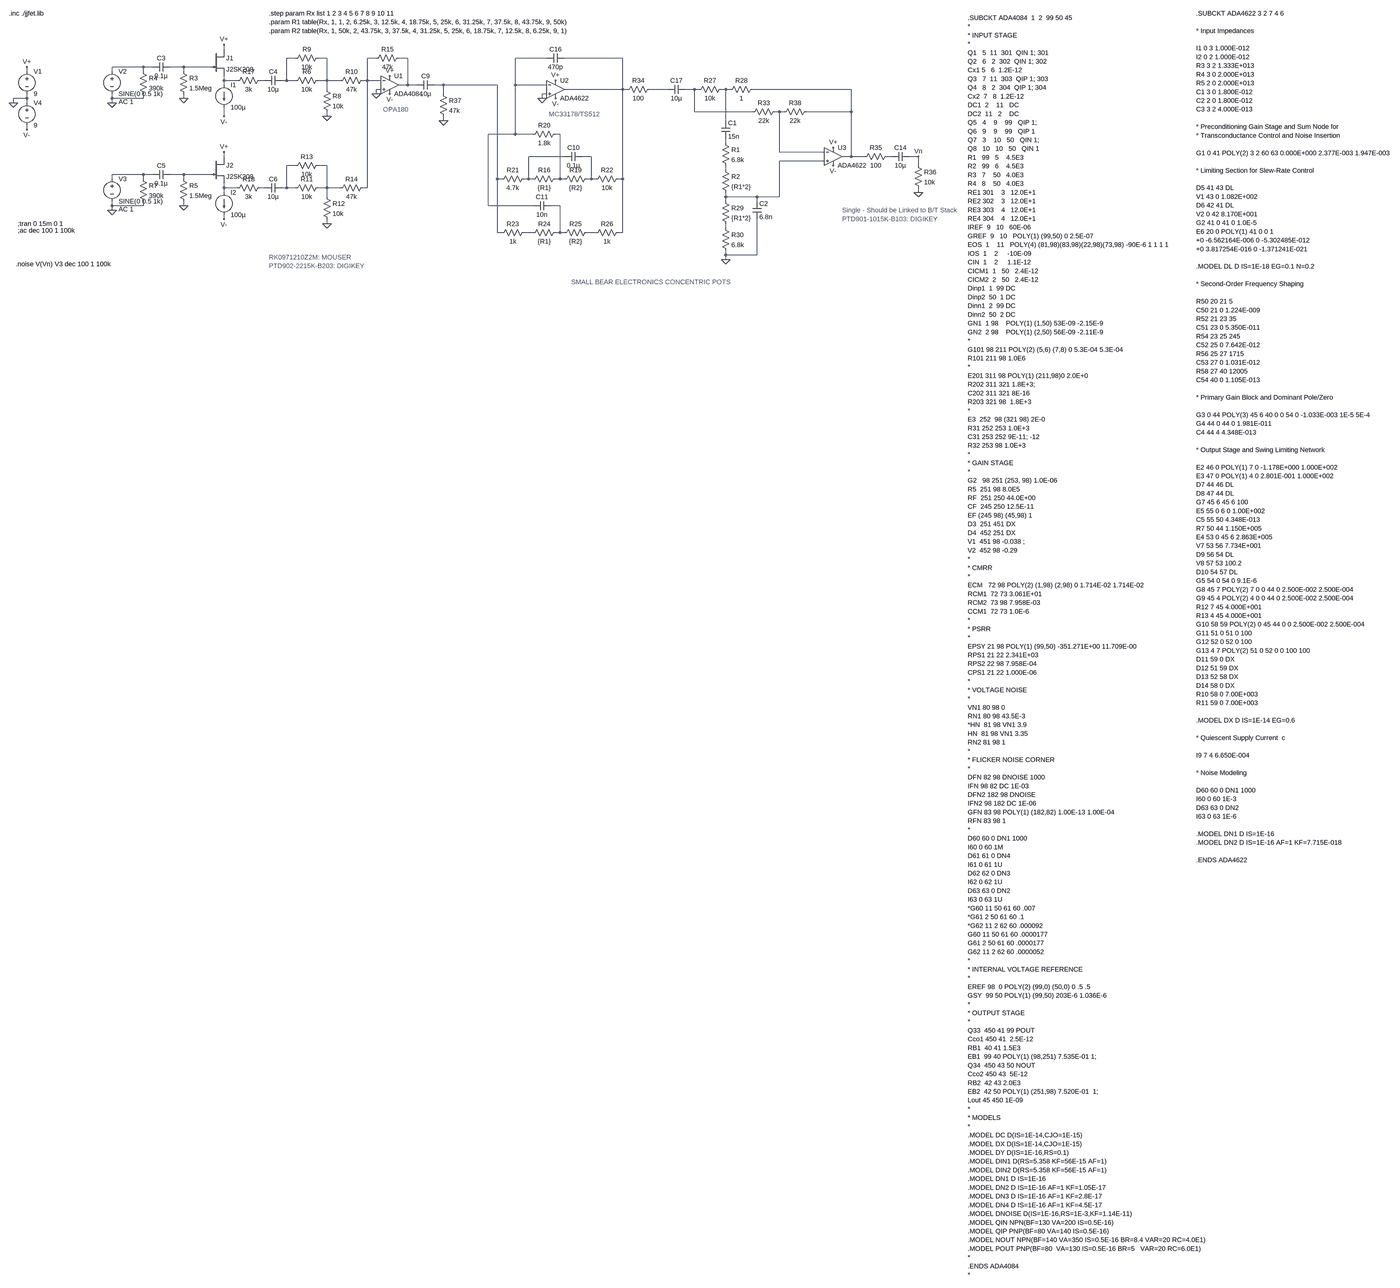
[diagram p0: schematic CB_BGP_V0.asc, whole sheet]
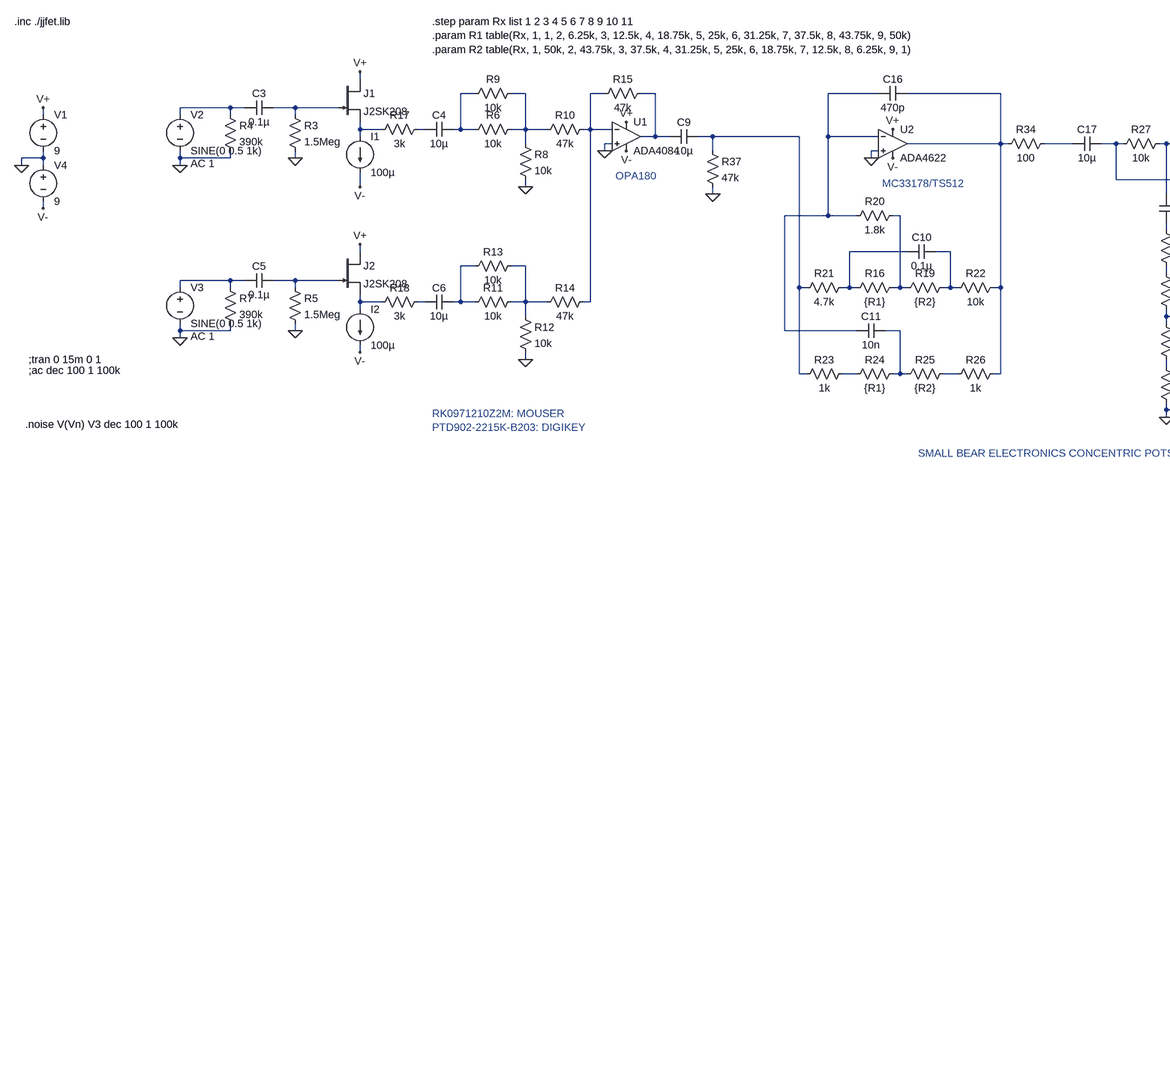
[diagram p1: schematic CB_BGP_V0.asc, part, row 1 of 2, column 1 of 2]
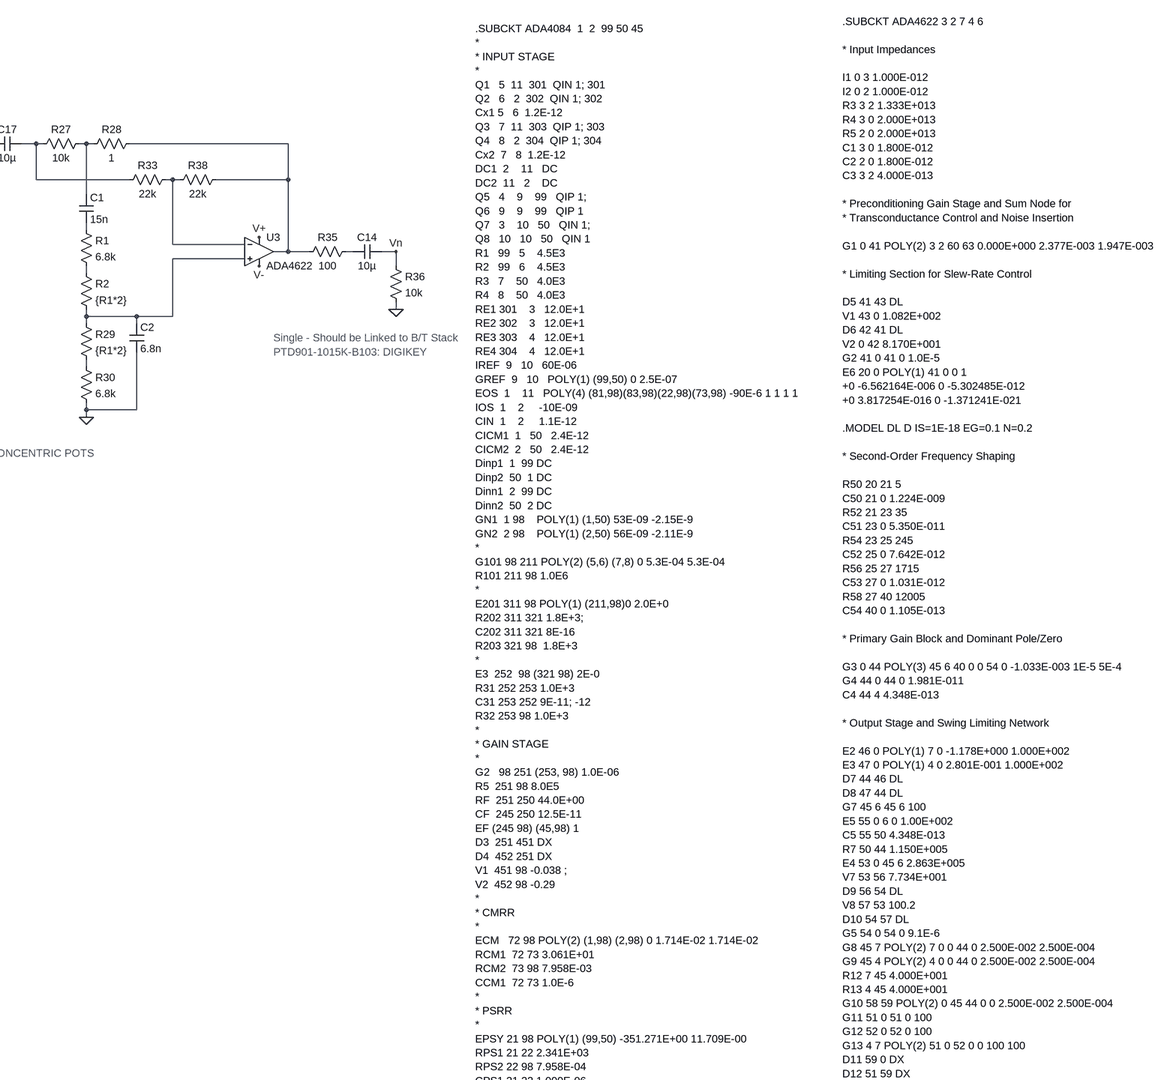
[diagram p2: schematic CB_BGP_V0.asc, part, row 1 of 2, column 2 of 2]
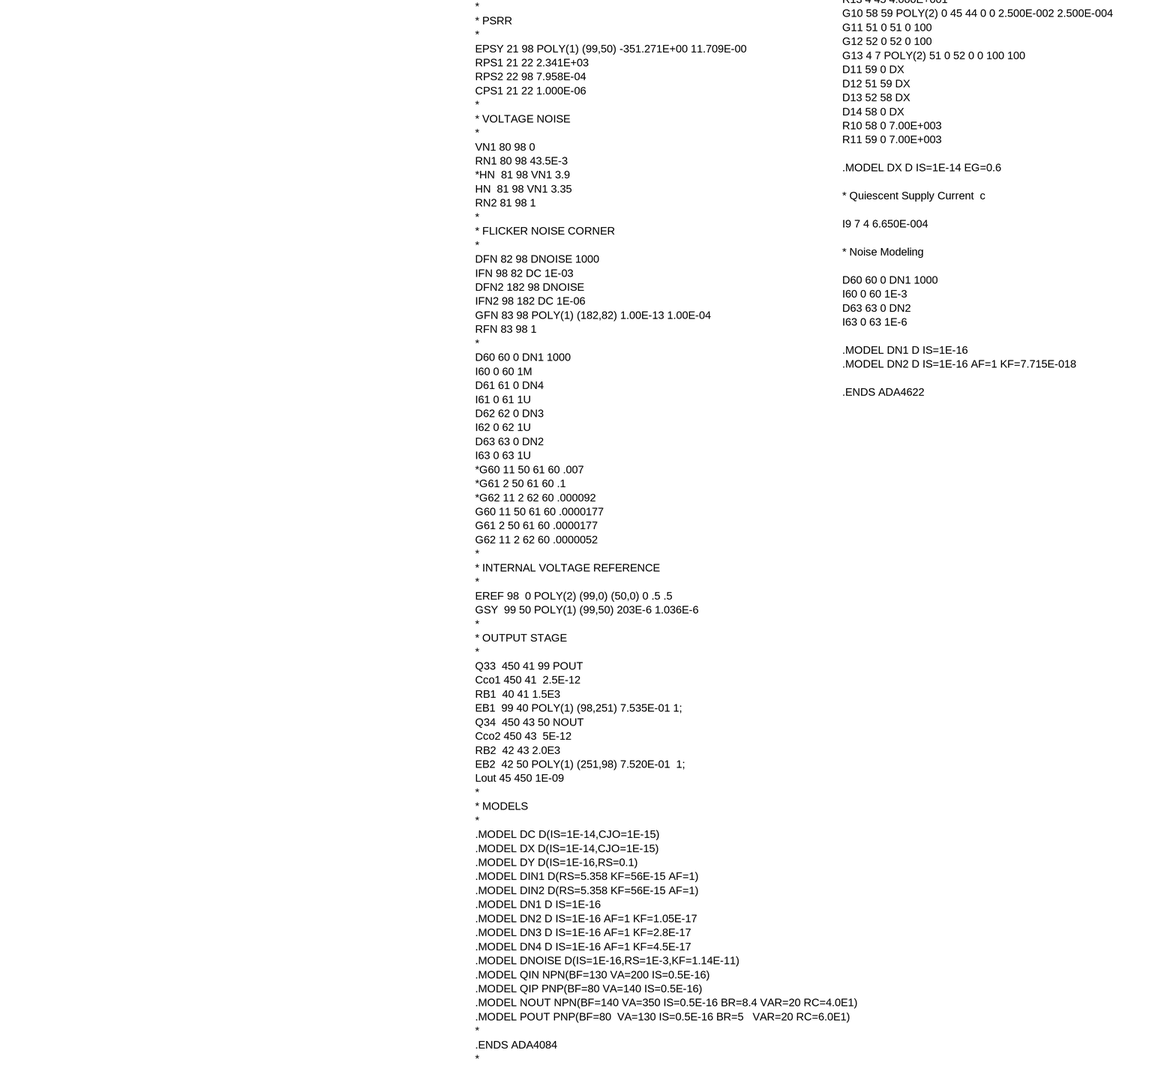
[diagram p3: schematic CB_BGP_V0.asc, part, row 2 of 2, column 2 of 2]
CB_BGP_V0.asc, the LTspice schematic file:
Version 4
SHEET 1 5040 4608
WIRE 880 0 880 -16
WIRE 1136 32 1104 32
WIRE 1248 32 1216 32
WIRE 1424 32 1392 32
WIRE 1536 32 1504 32
WIRE 2032 32 1920 32
WIRE 2304 32 2096 32
WIRE 592 64 480 64
WIRE 624 64 592 64
WIRE 736 64 688 64
WIRE 832 64 736 64
WIRE 176 80 176 64
WIRE 480 80 480 64
WIRE 592 80 592 64
WIRE 736 80 736 64
WIRE 880 112 880 96
WIRE 928 112 880 112
WIRE 1024 112 1008 112
WIRE 1104 112 1104 32
WIRE 1104 112 1088 112
WIRE 1136 112 1104 112
WIRE 1248 112 1248 32
WIRE 1248 112 1216 112
WIRE 1296 112 1248 112
WIRE 1392 112 1392 32
WIRE 1392 112 1376 112
WIRE 1440 112 1392 112
WIRE 880 128 880 112
WIRE 1536 128 1536 32
WIRE 1536 128 1504 128
WIRE 1568 128 1536 128
WIRE 1664 128 1632 128
WIRE 1856 128 1664 128
WIRE 1920 128 1920 32
WIRE 2032 128 1920 128
WIRE 1248 144 1248 112
WIRE 1440 144 1424 144
WIRE 2304 144 2304 32
WIRE 2304 144 2096 144
WIRE 2320 144 2304 144
WIRE 2464 144 2400 144
WIRE 2560 144 2528 144
WIRE 2576 144 2560 144
WIRE 2672 144 2656 144
WIRE 2688 144 2672 144
WIRE 3120 144 2768 144
WIRE 1424 160 1424 144
WIRE 1664 160 1664 128
WIRE 2032 160 2016 160
WIRE 176 176 176 160
WIRE 176 176 128 176
WIRE 480 176 480 160
WIRE 592 176 592 160
WIRE 592 176 480 176
WIRE 736 176 736 160
WIRE 2016 176 2016 160
WIRE 128 192 128 176
WIRE 176 192 176 176
WIRE 480 192 480 176
WIRE 2560 224 2560 144
WIRE 2768 224 2560 224
WIRE 2864 224 2848 224
WIRE 2880 224 2864 224
WIRE 3120 224 3120 144
WIRE 3120 224 2960 224
WIRE 880 240 880 208
WIRE 1248 240 1248 224
WIRE 1664 256 1664 240
WIRE 2672 256 2672 144
WIRE 176 288 176 272
WIRE 1920 304 1920 128
WIRE 1920 304 1824 304
WIRE 1984 304 1920 304
WIRE 2080 304 2064 304
WIRE 2672 336 2672 320
WIRE 2864 368 2864 224
WIRE 3024 368 2864 368
WIRE 880 384 880 368
WIRE 2096 384 1968 384
WIRE 2192 384 2160 384
WIRE 3120 384 3120 224
WIRE 3120 384 3088 384
WIRE 3168 384 3120 384
WIRE 3264 384 3248 384
WIRE 3360 384 3328 384
WIRE 3024 400 2864 400
WIRE 1136 416 1104 416
WIRE 1248 416 1216 416
WIRE 3360 416 3360 384
WIRE 2672 432 2672 416
WIRE 592 448 480 448
WIRE 624 448 592 448
WIRE 736 448 688 448
WIRE 832 448 736 448
WIRE 480 464 480 448
WIRE 592 464 592 448
WIRE 736 464 736 448
WIRE 1856 464 1856 128
WIRE 1872 464 1856 464
WIRE 1968 464 1968 384
WIRE 1968 464 1952 464
WIRE 1984 464 1968 464
WIRE 2080 464 2080 304
WIRE 2080 464 2064 464
WIRE 2096 464 2080 464
WIRE 2192 464 2192 384
WIRE 2192 464 2176 464
WIRE 2208 464 2192 464
WIRE 2304 464 2304 144
WIRE 2304 464 2288 464
WIRE 880 496 880 480
WIRE 928 496 880 496
WIRE 1024 496 1008 496
WIRE 1104 496 1104 416
WIRE 1104 496 1088 496
WIRE 1136 496 1104 496
WIRE 1248 496 1248 416
WIRE 1248 496 1216 496
WIRE 1296 496 1248 496
WIRE 1392 496 1392 112
WIRE 1392 496 1376 496
WIRE 880 512 880 496
WIRE 3360 512 3360 496
WIRE 1248 528 1248 496
WIRE 2672 528 2672 512
WIRE 2784 528 2672 528
WIRE 2864 528 2864 400
WIRE 2864 528 2784 528
WIRE 2672 544 2672 528
WIRE 2784 544 2784 528
WIRE 480 560 480 544
WIRE 592 560 592 544
WIRE 592 560 480 560
WIRE 736 560 736 544
WIRE 1824 560 1824 304
WIRE 1984 560 1824 560
WIRE 2080 560 2048 560
WIRE 480 576 480 560
WIRE 880 608 880 592
WIRE 1248 624 1248 608
WIRE 2672 640 2672 624
WIRE 1856 656 1856 464
WIRE 1872 656 1856 656
WIRE 1984 656 1952 656
WIRE 2080 656 2080 560
WIRE 2080 656 2064 656
WIRE 2096 656 2080 656
WIRE 2208 656 2176 656
WIRE 2304 656 2304 464
WIRE 2304 656 2288 656
WIRE 2672 736 2672 720
WIRE 2784 736 2784 608
WIRE 2784 736 2672 736
WIRE 2672 752 2672 736
FLAG 480 192 0
FLAG 880 -16 V+
FLAG 480 576 0
FLAG 880 368 V+
FLAG 1472 96 V+
FLAG 2064 112 V+
FLAG 3360 512 0
FLAG 3360 384 Vn
FLAG 3056 352 V+
FLAG 176 64 V+
FLAG 176 288 V-
FLAG 128 192 0
FLAG 736 560 0
FLAG 736 176 0
FLAG 1248 240 0
FLAG 1248 624 0
FLAG 1664 256 0
FLAG 1424 160 0
FLAG 2016 176 0
FLAG 880 240 V-
FLAG 880 608 V-
FLAG 1472 160 V-
FLAG 2064 176 V-
FLAG 3056 416 V-
FLAG 2672 752 0
SYMBOL voltage 176 64 R0
SYMATTR InstName V1
SYMATTR Value 9
SYMBOL voltage 480 64 R0
WINDOW 123 24 124 Left 2
WINDOW 39 0 0 Left 2
SYMATTR Value2 AC 1
SYMATTR InstName V2
SYMATTR Value SINE(0 0.5 1k)
SYMBOL res 720 64 R0
SYMATTR InstName R3
SYMATTR Value 1.5Meg
SYMBOL res 576 64 R0
SYMATTR InstName R4
SYMATTR Value 390k
SYMBOL cap 688 48 R90
WINDOW 0 0 32 VBottom 2
WINDOW 3 32 32 VTop 2
SYMATTR InstName C3
SYMATTR Value 0.1µ
SYMBOL njf 832 0 R0
SYMATTR InstName J1
SYMATTR Value J2SK208
SYMBOL current 880 128 R0
WINDOW 123 0 0 Left 2
WINDOW 39 0 0 Left 2
SYMATTR InstName I1
SYMATTR Value 100µ
SYMBOL cap 1088 96 R90
WINDOW 0 0 32 VBottom 2
WINDOW 3 32 32 VTop 2
SYMATTR InstName C4
SYMATTR Value 10µ
SYMBOL voltage 480 448 R0
WINDOW 123 24 124 Left 2
WINDOW 39 0 0 Left 2
SYMATTR Value2 AC 1
SYMATTR InstName V3
SYMATTR Value SINE(0 0.5 1k)
SYMBOL res 720 448 R0
SYMATTR InstName R5
SYMATTR Value 1.5Meg
SYMBOL res 576 448 R0
SYMATTR InstName R7
SYMATTR Value 390k
SYMBOL cap 688 432 R90
WINDOW 0 0 32 VBottom 2
WINDOW 3 32 32 VTop 2
SYMATTR InstName C5
SYMATTR Value 0.1µ
SYMBOL njf 832 384 R0
SYMATTR InstName J2
SYMATTR Value J2SK208
SYMBOL current 880 512 R0
WINDOW 123 0 0 Left 2
WINDOW 39 0 0 Left 2
SYMATTR InstName I2
SYMATTR Value 100µ
SYMBOL cap 1088 480 R90
WINDOW 0 0 32 VBottom 2
WINDOW 3 32 32 VTop 2
SYMATTR InstName C6
SYMATTR Value 10µ
SYMBOL res 1232 96 R90
WINDOW 0 0 56 VBottom 2
WINDOW 3 32 56 VTop 2
SYMATTR InstName R6
SYMATTR Value 10k
SYMBOL res 1232 128 R0
SYMATTR InstName R8
SYMATTR Value 10k
SYMBOL res 1232 16 R90
WINDOW 0 0 56 VBottom 2
WINDOW 3 32 56 VTop 2
SYMATTR InstName R9
SYMATTR Value 10k
SYMBOL res 1392 96 R90
WINDOW 0 0 56 VBottom 2
WINDOW 3 32 56 VTop 2
SYMATTR InstName R10
SYMATTR Value 47k
SYMBOL res 1232 480 R90
WINDOW 0 0 56 VBottom 2
WINDOW 3 32 56 VTop 2
SYMATTR InstName R11
SYMATTR Value 10k
SYMBOL res 1232 512 R0
SYMATTR InstName R12
SYMATTR Value 10k
SYMBOL res 1232 400 R90
WINDOW 0 0 56 VBottom 2
WINDOW 3 32 56 VTop 2
SYMATTR InstName R13
SYMATTR Value 10k
SYMBOL res 1392 480 R90
WINDOW 0 0 56 VBottom 2
WINDOW 3 32 56 VTop 2
SYMATTR InstName R14
SYMATTR Value 47k
SYMBOL res 1520 16 R90
WINDOW 0 0 56 VBottom 2
WINDOW 3 32 56 VTop 2
SYMATTR InstName R15
SYMATTR Value 47k
SYMBOL cap 1632 112 R90
WINDOW 0 0 32 VBottom 2
WINDOW 3 32 32 VTop 2
SYMATTR InstName C9
SYMATTR Value 10µ
SYMBOL res 1024 96 R90
WINDOW 0 0 56 VBottom 2
WINDOW 3 32 56 VTop 2
SYMATTR InstName R17
SYMATTR Value 3k
SYMBOL res 1024 480 R90
WINDOW 0 0 56 VBottom 2
WINDOW 3 32 56 VTop 2
SYMATTR InstName R18
SYMATTR Value 3k
SYMBOL res 2080 448 R90
WINDOW 0 0 56 VBottom 2
WINDOW 3 32 56 VTop 2
SYMATTR InstName R16
SYMATTR Value {R1}
SYMBOL res 2192 448 R90
WINDOW 0 0 56 VBottom 2
WINDOW 3 32 56 VTop 2
SYMATTR InstName R19
SYMATTR Value {R2}
SYMBOL cap 2160 368 R90
WINDOW 0 0 32 VBottom 2
WINDOW 3 32 32 VTop 2
SYMATTR InstName C10
SYMATTR Value 0.1µ
SYMBOL res 2080 288 R90
WINDOW 0 0 56 VBottom 2
WINDOW 3 32 56 VTop 2
SYMATTR InstName R20
SYMATTR Value 1.8k
SYMBOL res 1968 448 R90
WINDOW 0 0 56 VBottom 2
WINDOW 3 32 56 VTop 2
SYMATTR InstName R21
SYMATTR Value 4.7k
SYMBOL res 2304 448 R90
WINDOW 0 0 56 VBottom 2
WINDOW 3 32 56 VTop 2
SYMATTR InstName R22
SYMATTR Value 10k
SYMBOL res 1968 640 R90
WINDOW 0 0 56 VBottom 2
WINDOW 3 32 56 VTop 2
SYMATTR InstName R23
SYMATTR Value 1k
SYMBOL res 2080 640 R90
WINDOW 0 0 56 VBottom 2
WINDOW 3 32 56 VTop 2
SYMATTR InstName R24
SYMATTR Value {R1}
SYMBOL res 2192 640 R90
WINDOW 0 0 56 VBottom 2
WINDOW 3 32 56 VTop 2
SYMATTR InstName R25
SYMATTR Value {R2}
SYMBOL res 2304 640 R90
WINDOW 0 0 56 VBottom 2
WINDOW 3 32 56 VTop 2
SYMATTR InstName R26
SYMATTR Value 1k
SYMBOL cap 2048 544 R90
WINDOW 0 0 32 VBottom 2
WINDOW 3 32 32 VTop 2
SYMATTR InstName C11
SYMATTR Value 10n
SYMBOL res 2416 128 R90
WINDOW 0 0 56 VBottom 2
WINDOW 3 32 56 VTop 2
SYMATTR InstName R34
SYMATTR Value 100
SYMBOL cap 3328 368 R90
WINDOW 0 0 32 VBottom 2
WINDOW 3 32 32 VTop 2
SYMATTR InstName C14
SYMATTR Value 10µ
SYMBOL res 3264 368 R90
WINDOW 0 0 56 VBottom 2
WINDOW 3 32 56 VTop 2
SYMATTR InstName R35
SYMATTR Value 100
SYMBOL res 3344 400 R0
SYMATTR InstName R36
SYMATTR Value 10k
SYMBOL res 1648 144 R0
SYMATTR InstName R37
SYMATTR Value 47k
SYMBOL res 2672 128 R90
WINDOW 0 0 56 VBottom 2
WINDOW 3 32 56 VTop 2
SYMATTR InstName R27
SYMATTR Value 10k
SYMBOL res 2784 128 R90
WINDOW 0 0 56 VBottom 2
WINDOW 3 32 56 VTop 2
SYMATTR InstName R28
SYMATTR Value 1
SYMBOL res 2864 208 R90
WINDOW 0 0 56 VBottom 2
WINDOW 3 32 56 VTop 2
SYMATTR InstName R33
SYMATTR Value 22k
SYMBOL res 2976 208 R90
WINDOW 0 0 56 VBottom 2
WINDOW 3 32 56 VTop 2
SYMATTR InstName R38
SYMATTR Value 22k
SYMBOL cap 2096 16 R90
WINDOW 0 0 32 VBottom 2
WINDOW 3 32 32 VTop 2
SYMATTR InstName C16
SYMATTR Value 470p
SYMBOL cap 2528 128 R90
WINDOW 0 0 32 VBottom 2
WINDOW 3 32 32 VTop 2
SYMATTR InstName C17
SYMATTR Value 10µ
SYMBOL voltage 176 176 R0
SYMATTR InstName V4
SYMATTR Value 9
SYMBOL cap 2656 256 R0
SYMATTR InstName C1
SYMATTR Value 15n
SYMBOL res 2656 320 R0
SYMATTR InstName R1
SYMATTR Value 6.8k
SYMBOL res 2656 416 R0
SYMATTR InstName R2
SYMATTR Value {R1*2}
SYMBOL res 2656 528 R0
SYMATTR InstName R29
SYMATTR Value {R1*2}
SYMBOL res 2656 624 R0
SYMATTR InstName R30
SYMATTR Value 6.8k
SYMBOL cap 2768 544 R0
SYMATTR InstName C2
SYMATTR Value 6.8n
SYMBOL Opamps\\opamp2 1472 64 R0
SYMATTR InstName U1
SYMATTR Value ADA4084
SYMBOL Opamps\\opamp2 2064 80 R0
SYMATTR InstName U2
SYMATTR Value ADA4622
SYMBOL Opamps\\opamp2 3056 320 R0
SYMATTR InstName U3
SYMATTR Value ADA4622
TEXT 112 -128 Left 2 !.inc ./jjfet.lib
TEXT 144 624 Left 2 !;tran 0 15m 0 1
TEXT 144 648 Left 2 !;ac dec 100 1 100k
TEXT 1448 216 Left 2 ;OPA180
TEXT 1040 744 Left 2 ;RK0971210Z2M: MOUSER\nPTD902-2215K-B203: DIGIKEY
TEXT 2040 232 Left 2 ;MC33178/TS512
TEXT 1040 -128 Left 2 !.step param Rx list 1 2 3 4 5 6 7 8 9 10 11\n.param R1 table(Rx, 1, 1, 2, 6.25k, 3, 12.5k, 4, 18.75k, 5, 25k, 6, 31.25k, 7, 37.5k, 8, 43.75k, 9, 50k)\n.param R2 table(Rx, 1, 50k, 2, 43.75k, 3, 37.5k, 4, 31.25k, 5, 25k, 6, 18.75k, 7, 12.5k, 8, 6.25k, 9, 1)
TEXT 3088 576 Left 2 ;Single - Should be Linked to B/T Stack\nPTD901-1015K-B103: DIGIKEY
TEXT 136 768 Left 2 !.noise V(Vn) V3 dec 100 1 100k
TEXT 2120 832 Left 2 ;SMALL BEAR ELECTRONICS CONCENTRIC POTS
TEXT 3536 -112 Left 2 !.SUBCKT ADA4084  1  2  99 50 45\n*\n* INPUT STAGE\n*\nQ1   5  11  301  QIN 1; 301\nQ2   6   2  302  QIN 1; 302\nCx1 5   6  1.2E-12\nQ3   7  11  303  QIP 1; 303\nQ4   8   2  304  QIP 1; 304\nCx2  7   8  1.2E-12\nDC1  2    11   DC\nDC2  11   2    DC\nQ5   4    9    99   QIP 1;\nQ6   9    9    99   QIP 1\nQ7   3    10   50   QIN 1;\nQ8   10   10   50   QIN 1\nR1   99   5    4.5E3\nR2   99   6    4.5E3\nR3   7    50   4.0E3\nR4   8    50   4.0E3\nRE1 301    3   12.0E+1\nRE2 302    3   12.0E+1\nRE3 303    4   12.0E+1\nRE4 304    4   12.0E+1\nIREF  9   10   60E-06\nGREF  9   10   POLY(1) (99,50) 0 2.5E-07\nEOS  1    11   POLY(4) (81,98)(83,98)(22,98)(73,98) -90E-6 1 1 1 1\nIOS  1    2     -10E-09\nCIN  1    2     1.1E-12\nCICM1  1   50   2.4E-12\nCICM2  2   50   2.4E-12\nDinp1  1  99 DC\nDinp2  50  1 DC\nDinn1  2  99 DC\nDinn2  50  2 DC\nGN1  1 98    POLY(1) (1,50) 53E-09 -2.15E-9\nGN2  2 98    POLY(1) (2,50) 56E-09 -2.11E-9\n*\nG101 98 211 POLY(2) (5,6) (7,8) 0 5.3E-04 5.3E-04\nR101 211 98 1.0E6\n*\nE201 311 98 POLY(1) (211,98)0 2.0E+0\nR202 311 321 1.8E+3;\nC202 311 321 8E-16\nR203 321 98  1.8E+3\n*\nE3  252  98 (321 98) 2E-0\nR31 252 253 1.0E+3\nC31 253 252 9E-11; -12\nR32 253 98 1.0E+3\n*\n* GAIN STAGE\n*\nG2   98 251 (253, 98) 1.0E-06\nR5  251 98 8.0E5\nRF  251 250 44.0E+00\nCF  245 250 12.5E-11\nEF (245 98) (45,98) 1\nD3  251 451 DX\nD4  452 251 DX\nV1  451 98 -0.038 ;\nV2  452 98 -0.29\n*\n* CMRR\n*\nECM   72 98 POLY(2) (1,98) (2,98) 0 1.714E-02 1.714E-02\nRCM1  72 73 3.061E+01\nRCM2  73 98 7.958E-03\nCCM1  72 73 1.0E-6\n*\n* PSRR\n*\nEPSY 21 98 POLY(1) (99,50) -351.271E+00 11.709E-00\nRPS1 21 22 2.341E+03\nRPS2 22 98 7.958E-04\nCPS1 21 22 1.000E-06\n*\n* VOLTAGE NOISE\n*\nVN1 80 98 0\nRN1 80 98 43.5E-3\n*HN  81 98 VN1 3.9\nHN  81 98 VN1 3.35\nRN2 81 98 1\n*\n* FLICKER NOISE CORNER\n*\nDFN 82 98 DNOISE 1000\nIFN 98 82 DC 1E-03\nDFN2 182 98 DNOISE\nIFN2 98 182 DC 1E-06\nGFN 83 98 POLY(1) (182,82) 1.00E-13 1.00E-04\nRFN 83 98 1\n*\nD60 60 0 DN1 1000\nI60 0 60 1M\nD61 61 0 DN4\nI61 0 61 1U\nD62 62 0 DN3\nI62 0 62 1U\nD63 63 0 DN2\nI63 0 63 1U\n*G60 11 50 61 60 .007\n*G61 2 50 61 60 .1\n*G62 11 2 62 60 .000092\nG60 11 50 61 60 .0000177\nG61 2 50 61 60 .0000177\nG62 11 2 62 60 .0000052\n*\n* INTERNAL VOLTAGE REFERENCE\n*\nEREF 98  0 POLY(2) (99,0) (50,0) 0 .5 .5\nGSY  99 50 POLY(1) (99,50) 203E-6 1.036E-6\n*\n* OUTPUT STAGE\n*\nQ33  450 41 99 POUT\nCco1 450 41  2.5E-12\nRB1  40 41 1.5E3\nEB1  99 40 POLY(1) (98,251) 7.535E-01 1;\nQ34  450 43 50 NOUT\nCco2 450 43  5E-12\nRB2  42 43 2.0E3\nEB2  42 50 POLY(1) (251,98) 7.520E-01  1;\nLout 45 450 1E-09\n*\n* MODELS\n*\n.MODEL DC D(IS=1E-14,CJO=1E-15)\n.MODEL DX D(IS=1E-14,CJO=1E-15)\n.MODEL DY D(IS=1E-16,RS=0.1)\n.MODEL DIN1 D(RS=5.358 KF=56E-15 AF=1)\n.MODEL DIN2 D(RS=5.358 KF=56E-15 AF=1)\n.MODEL DN1 D IS=1E-16\n.MODEL DN2 D IS=1E-16 AF=1 KF=1.05E-17\n.MODEL DN3 D IS=1E-16 AF=1 KF=2.8E-17\n.MODEL DN4 D IS=1E-16 AF=1 KF=4.5E-17\n.MODEL DNOISE D(IS=1E-16,RS=1E-3,KF=1.14E-11)\n.MODEL QIN NPN(BF=130 VA=200 IS=0.5E-16)\n.MODEL QIP PNP(BF=80 VA=140 IS=0.5E-16)\n.MODEL NOUT NPN(BF=140 VA=350 IS=0.5E-16 BR=8.4 VAR=20 RC=4.0E1)\n.MODEL POUT PNP(BF=80  VA=130 IS=0.5E-16 BR=5   VAR=20 RC=6.0E1)\n*\n.ENDS ADA4084\n*
TEXT 4352 -128 Left 2 !.SUBCKT ADA4622 3 2 7 4 6\n \n* Input Impedances\n \nI1 0 3 1.000E-012\nI2 0 2 1.000E-012\nR3 3 2 1.333E+013\nR4 3 0 2.000E+013\nR5 2 0 2.000E+013\nC1 3 0 1.800E-012\nC2 2 0 1.800E-012\nC3 3 2 4.000E-013\n \n* Preconditioning Gain Stage and Sum Node for\n* Transconductance Control and Noise Insertion\n \nG1 0 41 POLY(2) 3 2 60 63 0.000E+000 2.377E-003 1.947E-003\n \n* Limiting Section for Slew-Rate Control\n \nD5 41 43 DL\nV1 43 0 1.082E+002\nD6 42 41 DL\nV2 0 42 8.170E+001\nG2 41 0 41 0 1.0E-5\nE6 20 0 POLY(1) 41 0 0 1\n+0 -6.562164E-006 0 -5.302485E-012\n+0 3.817254E-016 0 -1.371241E-021\n \n.MODEL DL D IS=1E-18 EG=0.1 N=0.2\n \n* Second-Order Frequency Shaping\n \nR50 20 21 5\nC50 21 0 1.224E-009\nR52 21 23 35\nC51 23 0 5.350E-011\nR54 23 25 245\nC52 25 0 7.642E-012\nR56 25 27 1715\nC53 27 0 1.031E-012\nR58 27 40 12005\nC54 40 0 1.105E-013\n \n* Primary Gain Block and Dominant Pole/Zero\n \nG3 0 44 POLY(3) 45 6 40 0 0 54 0 -1.033E-003 1E-5 5E-4\nG4 44 0 44 0 1.981E-011\nC4 44 4 4.348E-013\n \n* Output Stage and Swing Limiting Network\n \nE2 46 0 POLY(1) 7 0 -1.178E+000 1.000E+002\nE3 47 0 POLY(1) 4 0 2.801E-001 1.000E+002\nD7 44 46 DL\nD8 47 44 DL\nG7 45 6 45 6 100\nE5 55 0 6 0 1.00E+002\nC5 55 50 4.348E-013\nR7 50 44 1.150E+005\nE4 53 0 45 6 2.863E+005\nV7 53 56 7.734E+001\nD9 56 54 DL\nV8 57 53 100.2\nD10 54 57 DL\nG5 54 0 54 0 9.1E-6\nG8 45 7 POLY(2) 7 0 0 44 0 2.500E-002 2.500E-004\nG9 45 4 POLY(2) 4 0 0 44 0 2.500E-002 2.500E-004\nR12 7 45 4.000E+001\nR13 4 45 4.000E+001\nG10 58 59 POLY(2) 0 45 44 0 0 2.500E-002 2.500E-004\nG11 51 0 51 0 100\nG12 52 0 52 0 100\nG13 4 7 POLY(2) 51 0 52 0 0 100 100\nD11 59 0 DX\nD12 51 59 DX\nD13 52 58 DX\nD14 58 0 DX\nR10 58 0 7.00E+003\nR11 59 0 7.00E+003\n \n.MODEL DX D IS=1E-14 EG=0.6\n \n* Quiescent Supply Current  c         \n \nI9 7 4 6.650E-004\n \n* Noise Modeling\n \nD60 60 0 DN1 1000\nI60 0 60 1E-3\nD63 63 0 DN2\nI63 0 63 1E-6\n \n.MODEL DN1 D IS=1E-16\n.MODEL DN2 D IS=1E-16 AF=1 KF=7.715E-018\n \n.ENDS ADA4622

The netlist it stands for:
* CB_BGP_V0.asc
V1 V+ 0 9
V2 N007 0 SINE(0 0.5 1k) AC 1
R3 N008 0 1.5Meg
R4 N007 0 390k
C3 N008 N007 0.1µ
J1 V+ N008 N009 J2SK208
I1 N009 V- 100µ
C4 N001 N010 10µ
V3 N026 0 SINE(0 0.5 1k) AC 1
R5 N027 0 1.5Meg
R7 N026 0 390k
C5 N027 N026 0.1µ
J2 V+ N027 N028 J2SK208
I2 N028 V- 100µ
C6 N023 N029 10µ
R6 N002 N001 10k
R8 N002 0 10k
R9 N002 N001 10k
R10 N003 N002 47k
R11 N024 N023 10k
R12 N024 0 10k
R13 N024 N023 10k
R14 N003 N024 47k
R15 N004 N003 47k
C9 N011 N004 10µ
R17 N010 N009 3k
R18 N029 N028 3k
R16 N017 N019 {R1}
R19 N020 N017 {R2}
C10 N020 N019 0.1µ
R20 N017 N005 1.8k
R21 N019 N011 4.7k
R22 N006 N020 10k
R23 N032 N011 1k
R24 N030 N032 {R1}
R25 N033 N030 {R2}
R26 N006 N033 1k
C11 N030 N005 10n
R34 N012 N006 100
C14 Vn N021 10µ
R35 N021 N015 100
R36 Vn 0 10k
R37 N011 0 47k
R27 N014 N013 10k
R28 N015 N014 1
R33 N016 N013 22k
R38 N015 N016 22k
C16 N006 N005 470p
C17 N013 N012 10µ
V4 0 V- 9
C1 N014 N018 15n
R1 N018 N025 6.8k
R2 N025 N022 {R1*2}
R29 N022 N031 {R1*2}
R30 N031 0 6.8k
C2 N022 0 6.8n
XU1 0 N003 V+ V- N004 ADA4084  ; pins In+ In- V+ V- OUT
XU2 0 N005 V+ V- N006 ADA4622  ; pins In+ In- V+ V- OUT
XU3 N022 N016 V+ V- N015 ADA4622  ; pins In+ In- V+ V- OUT
.model NJF NJF
.model PJF PJF
.lib standard.jft
.inc ./jjfet.lib
;tran 0 15m 0 1
;ac dec 100 1 100k
* OPA180
* RK0971210Z2M: MOUSER
* PTD902-2215K-B203: DIGIKEY
* MC33178/TS512
.step param Rx list 1 2 3 4 5 6 7 8 9 10 11
.param R1 table(Rx, 1, 1, 2, 6.25k, 3, 12.5k, 4, 18.75k, 5, 25k, 6, 31.25k, 7, 37.5k, 8, 43.75k, 9, 50k)
.param R2 table(Rx, 1, 50k, 2, 43.75k, 3, 37.5k, 4, 31.25k, 5, 25k, 6, 18.75k, 7, 12.5k, 8, 6.25k, 9, 1)
* Single - Should be Linked to B/T Stack
* PTD901-1015K-B103: DIGIKEY
.noise V(Vn) V3 dec 100 1 100k
* SMALL BEAR ELECTRONICS CONCENTRIC POTS
.SUBCKT ADA4084  1  2  99 50 45
*
* INPUT STAGE
*
Q1   5  11  301  QIN 1; 301
Q2   6   2  302  QIN 1; 302
Cx1 5   6  1.2E-12
Q3   7  11  303  QIP 1; 303
Q4   8   2  304  QIP 1; 304
Cx2  7   8  1.2E-12
DC1  2    11   DC
DC2  11   2    DC
Q5   4    9    99   QIP 1;
Q6   9    9    99   QIP 1
Q7   3    10   50   QIN 1;
Q8   10   10   50   QIN 1
R1   99   5    4.5E3
R2   99   6    4.5E3
R3   7    50   4.0E3
R4   8    50   4.0E3
RE1 301    3   12.0E+1
RE2 302    3   12.0E+1
RE3 303    4   12.0E+1
RE4 304    4   12.0E+1
IREF  9   10   60E-06
GREF  9   10   POLY(1) (99,50) 0 2.5E-07
EOS  1    11   POLY(4) (81,98)(83,98)(22,98)(73,98) -90E-6 1 1 1 1
IOS  1    2     -10E-09
CIN  1    2     1.1E-12
CICM1  1   50   2.4E-12
CICM2  2   50   2.4E-12
Dinp1  1  99 DC
Dinp2  50  1 DC
Dinn1  2  99 DC
Dinn2  50  2 DC
GN1  1 98    POLY(1) (1,50) 53E-09 -2.15E-9
GN2  2 98    POLY(1) (2,50) 56E-09 -2.11E-9
*
G101 98 211 POLY(2) (5,6) (7,8) 0 5.3E-04 5.3E-04
R101 211 98 1.0E6
*
E201 311 98 POLY(1) (211,98)0 2.0E+0
R202 311 321 1.8E+3;
C202 311 321 8E-16
R203 321 98  1.8E+3
*
E3  252  98 (321 98) 2E-0
R31 252 253 1.0E+3
C31 253 252 9E-11; -12
R32 253 98 1.0E+3
*
* GAIN STAGE
*
G2   98 251 (253, 98) 1.0E-06
R5  251 98 8.0E5
RF  251 250 44.0E+00
CF  245 250 12.5E-11
EF (245 98) (45,98) 1
D3  251 451 DX
D4  452 251 DX
V1  451 98 -0.038 ;
V2  452 98 -0.29
*
* CMRR
*
ECM   72 98 POLY(2) (1,98) (2,98) 0 1.714E-02 1.714E-02
RCM1  72 73 3.061E+01
RCM2  73 98 7.958E-03
CCM1  72 73 1.0E-6
*
* PSRR
*
EPSY 21 98 POLY(1) (99,50) -351.271E+00 11.709E-00
RPS1 21 22 2.341E+03
RPS2 22 98 7.958E-04
CPS1 21 22 1.000E-06
*
* VOLTAGE NOISE
*
VN1 80 98 0
RN1 80 98 43.5E-3
*HN  81 98 VN1 3.9
HN  81 98 VN1 3.35
RN2 81 98 1
*
* FLICKER NOISE CORNER
*
DFN 82 98 DNOISE 1000
IFN 98 82 DC 1E-03
DFN2 182 98 DNOISE
IFN2 98 182 DC 1E-06
GFN 83 98 POLY(1) (182,82) 1.00E-13 1.00E-04
RFN 83 98 1
*
D60 60 0 DN1 1000
I60 0 60 1M
D61 61 0 DN4
I61 0 61 1U
D62 62 0 DN3
I62 0 62 1U
D63 63 0 DN2
I63 0 63 1U
*G60 11 50 61 60 .007
*G61 2 50 61 60 .1
*G62 11 2 62 60 .000092
G60 11 50 61 60 .0000177
G61 2 50 61 60 .0000177
G62 11 2 62 60 .0000052
*
* INTERNAL VOLTAGE REFERENCE
*
EREF 98  0 POLY(2) (99,0) (50,0) 0 .5 .5
GSY  99 50 POLY(1) (99,50) 203E-6 1.036E-6
*
* OUTPUT STAGE
*
Q33  450 41 99 POUT
Cco1 450 41  2.5E-12
RB1  40 41 1.5E3
EB1  99 40 POLY(1) (98,251) 7.535E-01 1;
Q34  450 43 50 NOUT
Cco2 450 43  5E-12
RB2  42 43 2.0E3
EB2  42 50 POLY(1) (251,98) 7.520E-01  1;
Lout 45 450 1E-09
*
* MODELS
*
.MODEL DC D(IS=1E-14,CJO=1E-15)
.MODEL DX D(IS=1E-14,CJO=1E-15)
.MODEL DY D(IS=1E-16,RS=0.1)
.MODEL DIN1 D(RS=5.358 KF=56E-15 AF=1)
.MODEL DIN2 D(RS=5.358 KF=56E-15 AF=1)
.MODEL DN1 D IS=1E-16
.MODEL DN2 D IS=1E-16 AF=1 KF=1.05E-17
.MODEL DN3 D IS=1E-16 AF=1 KF=2.8E-17
.MODEL DN4 D IS=1E-16 AF=1 KF=4.5E-17
.MODEL DNOISE D(IS=1E-16,RS=1E-3,KF=1.14E-11)
.MODEL QIN NPN(BF=130 VA=200 IS=0.5E-16)
.MODEL QIP PNP(BF=80 VA=140 IS=0.5E-16)
.MODEL NOUT NPN(BF=140 VA=350 IS=0.5E-16 BR=8.4 VAR=20 RC=4.0E1)
.MODEL POUT PNP(BF=80  VA=130 IS=0.5E-16 BR=5   VAR=20 RC=6.0E1)
*
.ENDS ADA4084
*
.SUBCKT ADA4622 3 2 7 4 6
* Input Impedances
I1 0 3 1.000E-012
I2 0 2 1.000E-012
R3 3 2 1.333E+013
R4 3 0 2.000E+013
R5 2 0 2.000E+013
C1 3 0 1.800E-012
C2 2 0 1.800E-012
C3 3 2 4.000E-013
* Preconditioning Gain Stage and Sum Node for
* Transconductance Control and Noise Insertion
G1 0 41 POLY(2) 3 2 60 63 0.000E+000 2.377E-003 1.947E-003
* Limiting Section for Slew-Rate Control
D5 41 43 DL
V1 43 0 1.082E+002
D6 42 41 DL
V2 0 42 8.170E+001
G2 41 0 41 0 1.0E-5
E6 20 0 POLY(1) 41 0 0 1
+0 -6.562164E-006 0 -5.302485E-012
+0 3.817254E-016 0 -1.371241E-021
.MODEL DL D IS=1E-18 EG=0.1 N=0.2
* Second-Order Frequency Shaping
R50 20 21 5
C50 21 0 1.224E-009
R52 21 23 35
C51 23 0 5.350E-011
R54 23 25 245
C52 25 0 7.642E-012
R56 25 27 1715
C53 27 0 1.031E-012
R58 27 40 12005
C54 40 0 1.105E-013
* Primary Gain Block and Dominant Pole/Zero
G3 0 44 POLY(3) 45 6 40 0 0 54 0 -1.033E-003 1E-5 5E-4
G4 44 0 44 0 1.981E-011
C4 44 4 4.348E-013
* Output Stage and Swing Limiting Network
E2 46 0 POLY(1) 7 0 -1.178E+000 1.000E+002
E3 47 0 POLY(1) 4 0 2.801E-001 1.000E+002
D7 44 46 DL
D8 47 44 DL
G7 45 6 45 6 100
E5 55 0 6 0 1.00E+002
C5 55 50 4.348E-013
R7 50 44 1.150E+005
E4 53 0 45 6 2.863E+005
V7 53 56 7.734E+001
D9 56 54 DL
V8 57 53 100.2
D10 54 57 DL
G5 54 0 54 0 9.1E-6
G8 45 7 POLY(2) 7 0 0 44 0 2.500E-002 2.500E-004
G9 45 4 POLY(2) 4 0 0 44 0 2.500E-002 2.500E-004
R12 7 45 4.000E+001
R13 4 45 4.000E+001
G10 58 59 POLY(2) 0 45 44 0 0 2.500E-002 2.500E-004
G11 51 0 51 0 100
G12 52 0 52 0 100
G13 4 7 POLY(2) 51 0 52 0 0 100 100
D11 59 0 DX
D12 51 59 DX
D13 52 58 DX
D14 58 0 DX
R10 58 0 7.00E+003
R11 59 0 7.00E+003
.MODEL DX D IS=1E-14 EG=0.6
* Quiescent Supply Current  c
I9 7 4 6.650E-004
* Noise Modeling
D60 60 0 DN1 1000
I60 0 60 1E-3
D63 63 0 DN2
I63 0 63 1E-6
.MODEL DN1 D IS=1E-16
.MODEL DN2 D IS=1E-16 AF=1 KF=7.715E-018
.ENDS ADA4622
.backanno
.end